# Altium schematic sheet DAC.SchDoc
size A4; DocumentNumber: 7; SheetNumber: 7; SheetTotal: 11
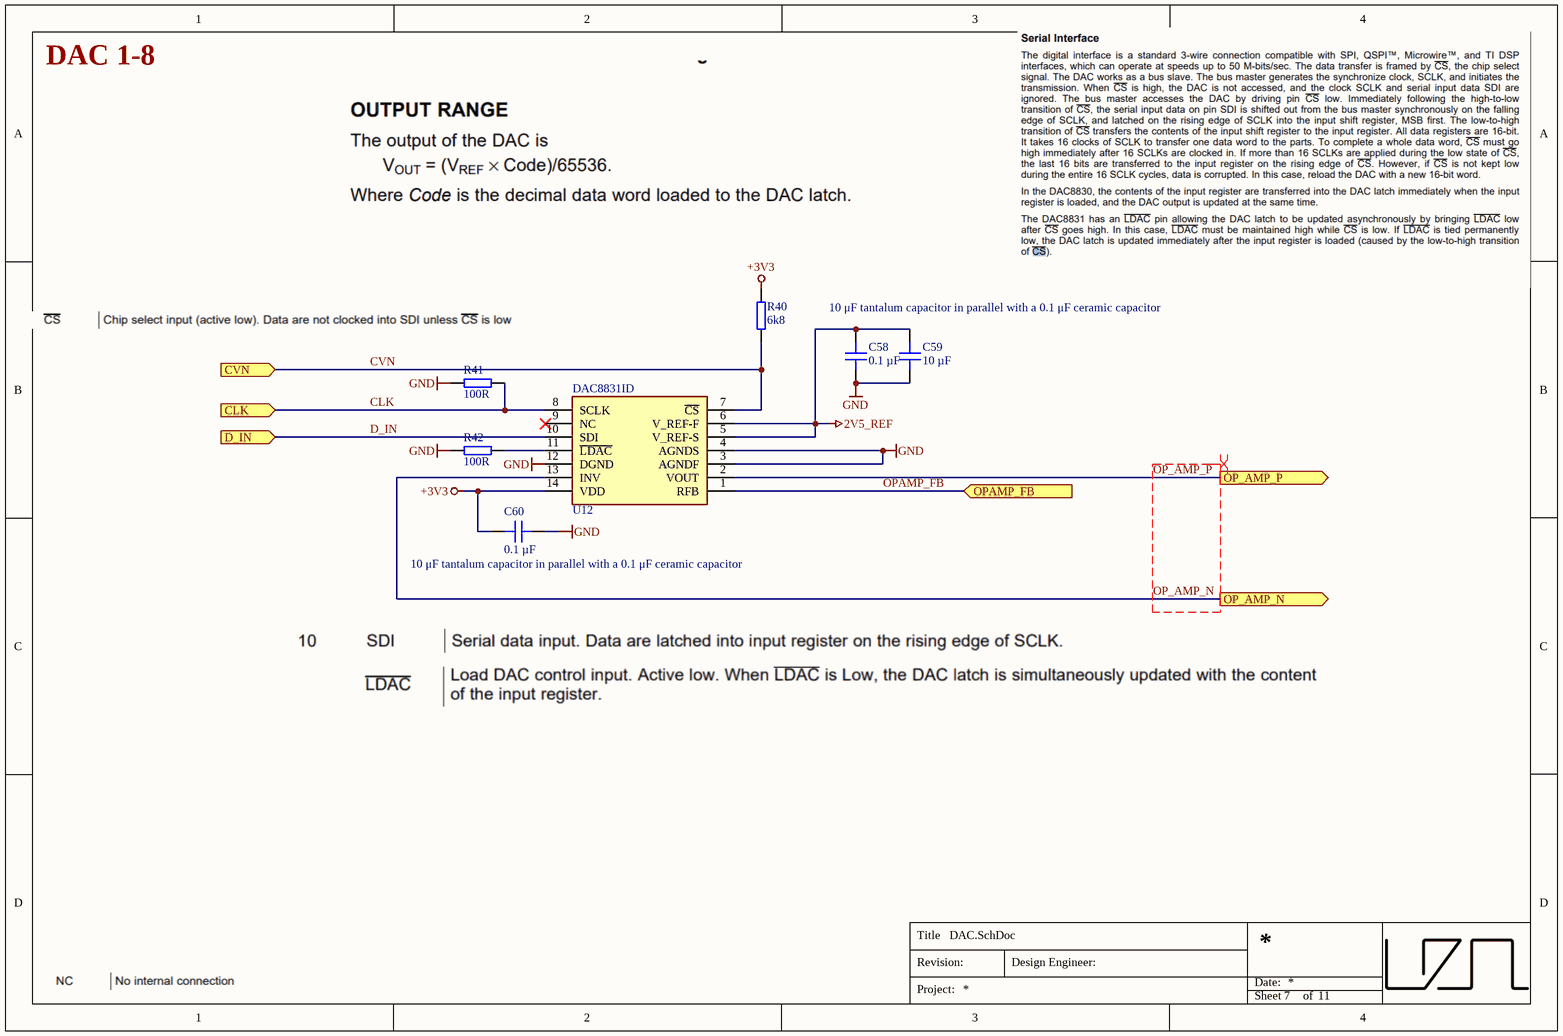
[diagram p0: DAC.SchDoc]

## Parts
C58  0.1 µF  [C_0603]
C59  10 µF  [C_1206]
C60  0.1 µF  [C_0603]
R40  6k8  [RES 0603_1608]
R41  100R  [RES 0603_1608]
R42  100R  [RES 0603_1608]
U12  DAC8831ID  [SOIC127P600X175-14N]

## Ports
CLK (in), CVN (in), D_IN (in), OP_AMP_N (out), OP_AMP_P (out), OPAMP_FB (in)

## Nets
2V5_REF: C58.1 C59.2 U12.5(V_REF-S) U12.6(V_REF-F)
+3V3: C60.2 R40.2 U12.14(VDD)
GND: C58.2 C59.1 C60.1 R41.2 R42.2 U12.3(AGNDF) U12.4(AGNDS) U12.12(DGND)
CLK: R41.1 U12.8(SCLK) ; port CLK
CVN: R40.1 U12.7(~{CS}) ; port CVN
D_IN: U12.10(SDI) ; port D_IN
OP_AMP_N: U12.13(INV) ; port OP_AMP_N
OP_AMP_P: U12.2(VOUT) ; port OP_AMP_P
OPAMP_FB: U12.1(RFB) ; port OPAMP_FB
NetR42_1: R42.1 U12.11(~{LDAC})

Not connected (* = marked no-connect by the designer): U12 9(NC)*

## Layout directives
differential pair: OP_AMP_N, OP_AMP_P

## Notes on the sheet
- DAC 1-8
- 10 μF tantalum capacitor in parallel with a 0.1 μF ceramic capacitor
- (near C60) 10 μF tantalum capacitor in parallel with a 0.1 μF ceramic capacitor
- Title
- Revision:
- Design Engineer:
- Date:
- Project:
- Sheet
- of

## Library data of the parts
C58 C60 = C0603X104K5RAC7411: Capacitor 0603, 50 VDC, 0.1 µF, X7R; Manufacturer: KEMET; Tolerance: 10 %; Voltage Rating: 50 VDC; Created from: MGremer; Manufacturer Part Number: C0603X104K5RAC7411; PartID: 3; Created On: 20.12.2020 13:54:13; ComponentLink1Description: Datasheet; ComponentLink1URL: https://www.mouser.de/datasheet/2/212/1/KEM_C1013_X7R_FT_CAP_SMD-1103280.pdf; Component Type: Capacitor 0603; Device Package: 0603; Last Updated: 04.03.2021 09:24:28; Mounting Type: SMD; Operating Temperature: -55 - 125°C; Series: SMD Comm X7R Flex; Supplier 1: Mouser; Supplier Part Number 1: 80-C0603X104K5R7411; Supplier 2: LCSC; Supplier Part Number 2: C14663; Type: Capacitor; Value: 0.1 µF; Live Cycle Status: 1; LCSC Part Number: C14663; Stock number: Labor SMD Container
C59 = GRT31CR61H106KE01L: Capacitor 1206, 50 VDC, 10 µF, X5R; Manufacturer: Murata Electronics; Tolerance: 10 %; Voltage Rating: 50 VDC; Created from: MGremer; Manufacturer Part Number: GRT31CR61H106KE01L; PartID: 65; Created On: 20.12.2020 13:54:13; ComponentLink1Description: Datasheet; ComponentLink1URL: https://www.mouser.de/datasheet/2/281/1/GRT31CR61H106KE01_01-1989724.pdf; Component Type: Capacitor 1206; Device Package: 1206; Last Updated: 20.12.2020 16:34:30; Mounting Type: SMD; Operating Temperature: -55 - 85°C; Series: GRT; Supplier 1: Mouser; Supplier Part Number 1: 81-GRT31CR61H106KE1L; Type: Capacitor; Value: 10 µF; Live Cycle Status: 1; Stock number: Labor SMD Container
R40 = RK73B1JTTDD682J: SMD resistor E24 series; Manufacturer: KOA Speer; Tolerance: 5%; Created from: MGremer; Manufacturer Part Number: RK73B1JTTDD682J; PartID: 94; Created On: 14.12.2020 16:17:14; ComponentLink1Description: Datasheet; ComponentLink1URL: https://www.mouser.de/datasheet/2/219/RK73B-1825463.pdf; Component Type: SMD resistor; Device Package: 0603; Last Updated: 02.03.2021 14:07:32; Mounting Type: SMD; Supplier 1: Mouser; Supplier Part Number 1: 660-RK73B1JTTDD682J; Type: Resistor; Value: 6k8; Live Cycle Status: 1; Stock number: Labor SMD Container
R41 R42 = AC0603FR-13100RL: SMD resistor 1%; Manufacturer: Yageo; Created from: MGremer; Manufacturer Part Number: AC0603FR-13100RL; PartID: 161; Created On: 14.12.2020 16:17:14; ComponentLink1Description: Datasheet; ComponentLink1URL: https://www.mouser.de/datasheet/2/447/PYu-AC_51_RoHS_L_7-1714230.pdf; Component Type: SMD resistor; Device Package: 0603; Last Updated: 02.03.2021 14:07:32; Mounting Type: SMD; Supplier 1: Mouser; Supplier Part Number 1: 603-AC0603FR-13100RL; Type: Resistor; Tolerance: 1%; Value: 100R; Live Cycle Status: 1; Stock number: not stored
U12 = DAC8831ID: 16-Bit, Ultra-Low Power, Voltage-OutputcDigital-to-Analog Converters; Manufacturer_Name: Texas Instruments; Manufacturer: TI; Channels: 1; Sampling Rate: 2 MS/s; Interface Type: 3-Wire, DSP, Microwire, QSPI, SPI; Architecture: R-2R; Supply Voltage: 2.7 V to 5.5 V; Created from: MHlatky; Datasheet Link: http://www.ti.com/lit/gpn/dac8831; Height: 1.75mm; Manufacturer_Part_Number: DAC8831ID; Manufacturer Part Number: DAC8831ID; PartID: 2; Created On: 03.03.2022 16:53:36; ComponentLink1Description: Datasheet; ComponentLink1URL: https://www.ti.com/lit/ds/slas449d/slas449d.pdf?ts=1646313854062&ref_url=https%253A%252F%252Fwww.google.com%252F; Component Type: DAC8831; Last Updated: 08.03.2022 10:45:20; Mounting Type: SOIC; Operating Temperature: -40 - 85; Supplier 1: Mouser; Supplier Part Number 1: 595-DAC8831ID; Type: DAC; Resolution: 16-Bit; Live Cycle Status: 1